# EAGLE schematic Tock (EAGLE 7.2.0)
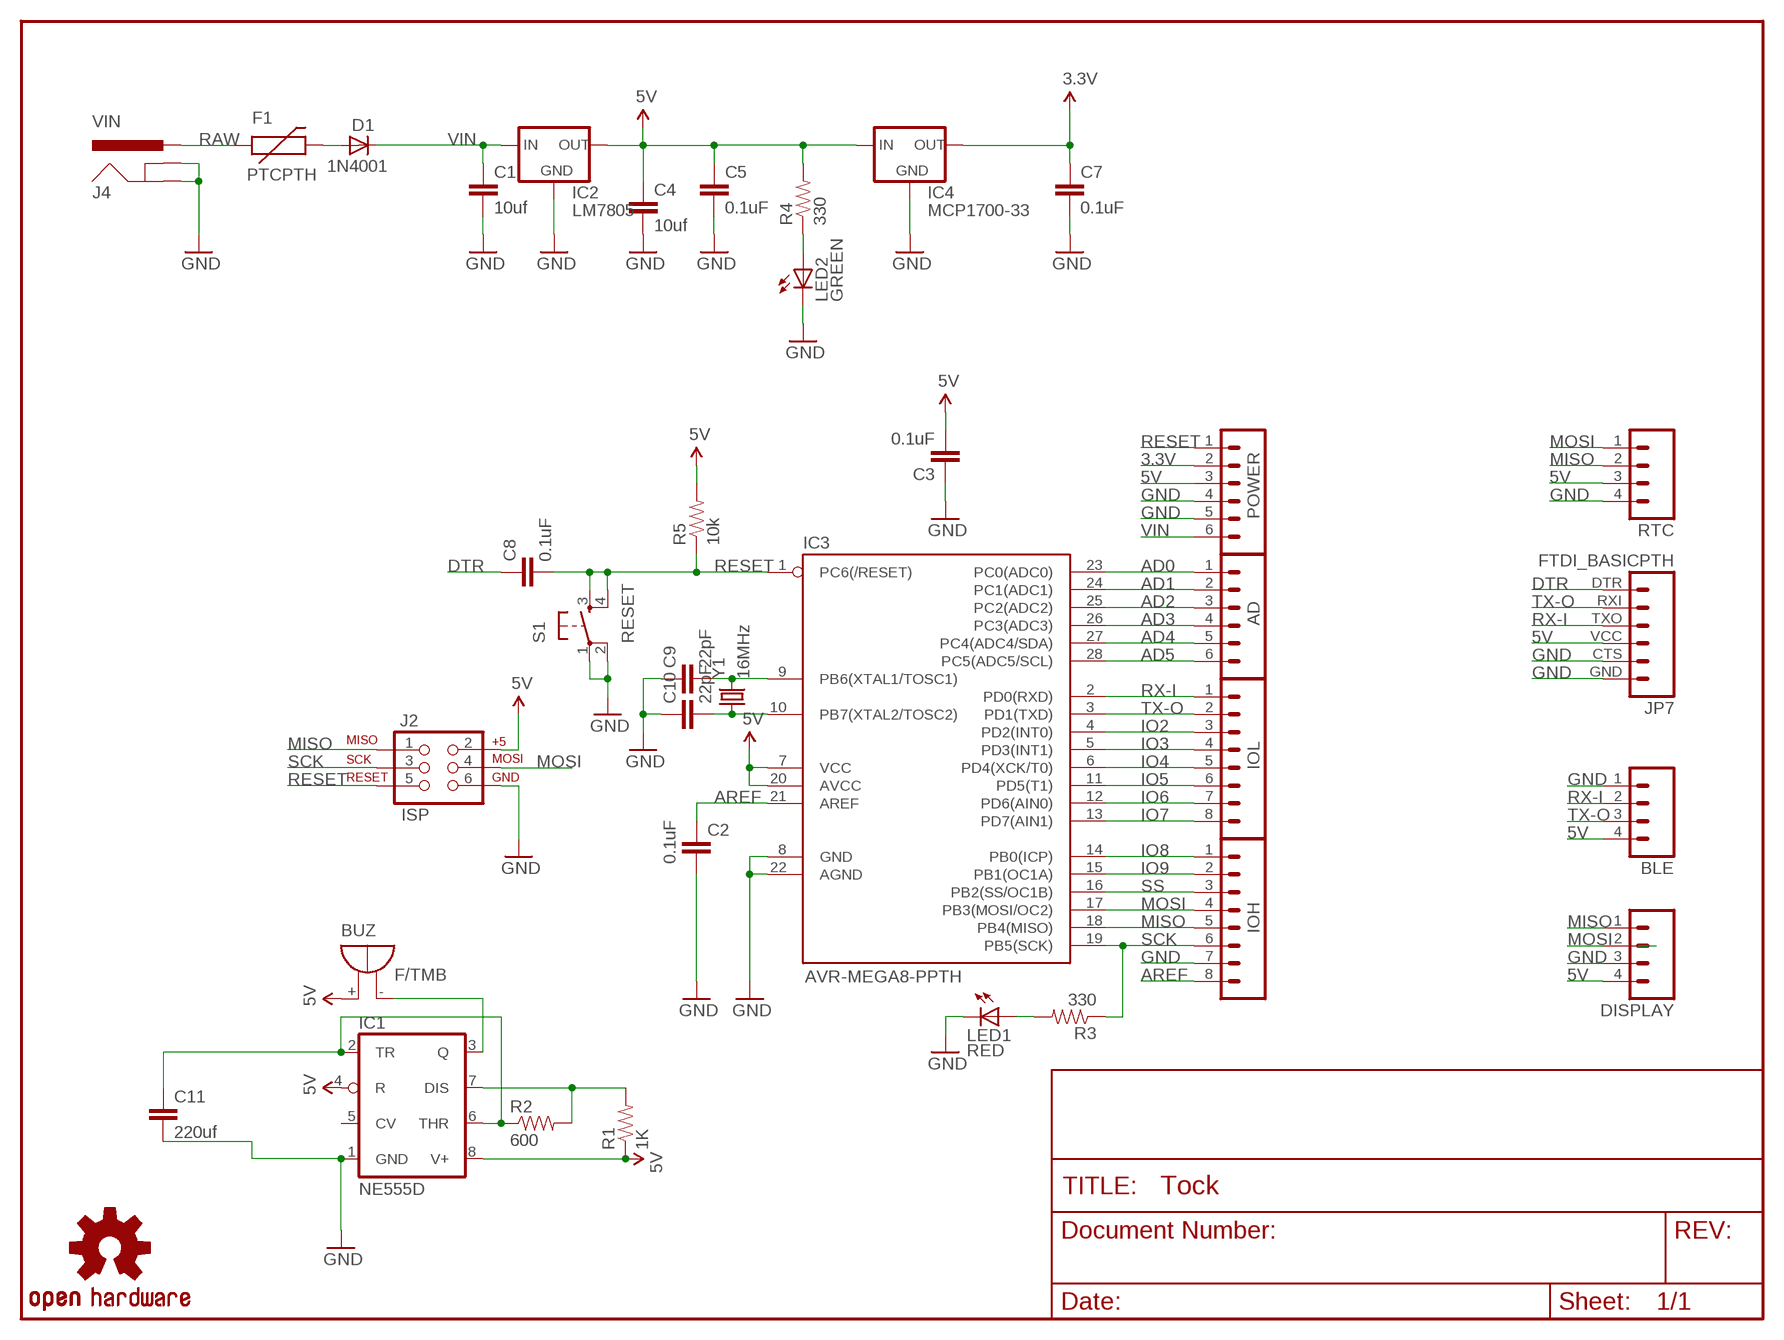
[diagram p0: schematic, sheet 1]

## Parts
AD  M06LOCK  [1X06_LOCK]
BLE  M04LOCK  [1X04_LOCK]
BUZ  F/TMB  [F/TMB]
C1  10uf  CAP0805  [0805]
C2  0.1uF  CAP0805  [0805]
C3  0.1uF  CAPPTH2  [CAP-PTH-SMALL2]
C4  10uf  CAP0805  [0805]
C5  0.1uF  CAP0805  [0805]
C7  0.1uF  CAP0805  [0805]
C8  0.1uF  CAP0805  [0805]
C9  22pF  CAP0805  [0805]
C10  22pF  CAP0805  [0805]
C11  220uf  CAP0805  [0805]
D1  1N4001  DIODEPTH  [DIODE-1N4001]
DISPLAY  M04LOCK  [1X04_LOCK]
F1  PTCPTH  [PTC]
IC1  NE555D  [SO08]
IC2  LM7805  V_REG_78XX-TO-220  [TO-220-ALT]
IC3  AVR-MEGA8-PPTH  [DIL28-3]
IC4  MCP1700-33  V_REG_78XXTO-92  [TO-92]
IOH  M08LOCK  [1X08_LOCK]
IOL  M08LOCK  [1X08_LOCK]
J2  ISP  AVR_SPI_PRG_6PTH  [2X3]
J4  VIN  POWER_JACKPTH_LOCK  [POWER_JACK_PTH_LOCK]
JP7  FTDI_BASICPTH  [FTDI_BASIC]
LED1  RED  LEDCHIP-LED0805  [CHIP-LED0805]
LED2  GREEN  LEDCHIP-LED0805  [CHIP-LED0805]
POWER  M06LOCK  [1X06_LOCK]
R1  1K  RESISTOR0805-RES  [0805]
R2  600  RESISTOR0805-RES  [0805]
R3  330  RESISTOR0805-RES  [0805]
R4  330  RESISTOR0805-RES  [0805]
R5  10k  RESISTOR0805-RES  [0805]
RTC  M04LOCK  [1X04_LOCK]
S1  RESET  TAC_SWITCHPTH  [TACTILE-PTH]
U$7  OSHW-LOGOM  [OSHW-LOGO-M]
Y1  16MHz  CRYSTALHC49US  [HC49US]

## Nets
3.3V: C7.1 IC4.3(OUT) POWER.2
5V [power]: BLE.4 BUZ.+ C3.2 C4.1 C5.1 DISPLAY.4 IC1.4(R) IC1.8(V+) IC2.OUT IC3.7(VCC) IC3.20(AVCC) IC4.2(IN) J2.2 JP7.VCC POWER.3 R1.1 R4.2 R5.2 RTC.3
AD0 [outpin]: AD.1 IC3.23(PC0(ADC0))
AD1 [outpin]: AD.2 IC3.24(PC1(ADC1))
AD2 [outpin]: AD.3 IC3.25(PC2(ADC2))
AD3 [outpin]: AD.4 IC3.26(PC3(ADC3))
AD4 [outpin]: AD.5 IC3.27(PC4(ADC4/SDA))
AD5 [outpin]: AD.6 IC3.28(PC5(ADC5/SCL))
AREF [outpin]: C2.1 IC3.21(AREF) IOH.8
DTR: C8.1 JP7.DTR
GND [power]: BLE.1 C1.2 C2.2 C3.1 C4.2 C5.2 C7.2 C9.1 C10.1 C11.2 DISPLAY.3 IC1.1(GND) IC2.GND IC3.8(GND) IC3.22(AGND) IC4.1(GND) IOH.7 J2.6 J4.GND J4.GNDBREAK JP7.CTS JP7.GND LED1.C LED2.C POWER.4 POWER.5 RTC.4 S1.1 S1.2
IO2 [outpin]: IC3.4(PD2(INT0)) IOL.3
IO3 [outpin]: IC3.5(PD3(INT1)) IOL.4
IO4 [outpin]: IC3.6(PD4(XCK/T0)) IOL.5
IO5 [outpin]: IC3.11(PD5(T1)) IOL.6
IO6 [outpin]: IC3.12(PD6(AIN0)) IOL.7
IO7 [outpin]: IC3.13(PD7(AIN1)) IOL.8
IO8 [outpin]: IC3.14(PB0(ICP)) IOH.1
IO9 [outpin]: IC3.15(PB1(OC1A)) IOH.2
MISO [outpin]: DISPLAY.1 IC3.18(PB4(MISO)) IOH.5 J2.1 RTC.2
MOSI: DISPLAY.2 IC3.17(PB3(MOSI/OC2)) IOH.4 J2.4 RTC.1
N$1: LED1.A R3.2
N$2: LED2.A R4.1
N$3: C9.2 IC3.9(PB6(XTAL1/TOSC1)) Y1.2
N$4: C10.2 IC3.10(PB7(XTAL2/TOSC2)) Y1.1
N$5: C11.1 IC1.2(TR) IC1.6(THR) R2.1
N$6: D1.A F1.P$2
N$7: BUZ.- IC1.3(Q)
N$9: IC1.7(DIS) R1.2 R2.2
RAW [power]: F1.P$1 J4.PWR
RESET: C8.2 IC3.1(PC6(/RESET)) J2.5 POWER.1 R5.1 S1.3 S1.4
RX-I [outpin]: BLE.2 IC3.2(PD0(RXD)) IOL.1 JP7.TXO
SCK [outpin]: IC3.19(PB5(SCK)) IOH.6 J2.3 R3.1
SS [outpin]: IC3.16(PB2(SS/OC1B)) IOH.3
TX-O [outpin]: BLE.3 IC3.3(PD1(TXD)) IOL.2 JP7.RXI
VIN [power]: C1.1 D1.C IC2.IN POWER.6
Unconnected: IC1.5(CV)

## Library data of the parts
AD POWER = SparkFun-Connectors:M06: Header 6 Standard 6-pin 0.1" header. Use with straight break away headers (SKU : PRT-00116), right angle break away headers (PRT-00553), swiss pins (PRT-00743), machine pins (PRT-00117), and female headers (PRT-00115). Molex polarized connector foot print use with SKU : PRT-08094 with associated crimp pins and housings. NOTES ON THE VARIANTS LOCK and LOCK_LONGPADS... This footprint was designed to help hold the alignment of a through-hole component (i.e. 6-pin header) while soldering it into place. You may notice that each hole has been shifted either up or down by 0.005 of an inch from it's more standard position (which is a perfectly straight line). This slight alteration caused the pins (the squares in the middle) to touch the edges of the holes. Because they are alternating, it causes a "brace" to hold the component in place. 0.005 has proven to be the perfect amount of "off-center" position when using our standard breakaway headers. Although looks a little odd when you look at the bare footprint, once you have a header in there, the alteration is very hard to notice. Also,if you push a header all the way into place, it is covered up entirely on the bottom side. This idea of altering the position of holes to aid alignment will be further integrated into the Sparkfun Library for other footprints. It can help hold any component with 3 or more connection pins.
BLE DISPLAY RTC = SparkFun-Connectors:M04: Header 4 Standard 4-pin 0.1" header. Use with straight break away headers (SKU : PRT-00116), right angle break away headers (PRT-00553), swiss pins (PRT-00743), machine pins (PRT-00117), and female headers (PRT-00115). Molex polarized connector foot print use with SKU : PRT-08231 with associated crimp pins and housings. 1MM SMD Version SKU: PRT-10208
BUZ = buzzer:F/TMB: BUZZER Source: Buerklin; OC_FARNELL: unknown; OC_NEWARK: unknown
C1 C2 C4 C5 C7-C11 = SparkFun-Passives:CAP: Capacitor Standard 0603 ceramic capacitor, and 0.1" leaded capacitor.
C3 = SparkFun:CAP: Capacitor Standard 0603 ceramic capacitor, and 0.1" leaded capacitor.
D1 = SparkFun:DIODE: Diode These are standard reverse protection diodes and small signal diodes. SMA package can handle up to about 1A. SOD-323 can handle about 200mA. What the SOD-323 package when ordering, there are some mfgs out there that are 5-pin packages.
F1 = SparkFun:PTC: Resettable Fuse PTC Resettable Fuse. Spark Fun Electronics SKU : COM-08357
IC1 = linear:*555: TIMER
IC2 IC4 = SparkFun:V_REG_78XX: Voltage Regulator Standard 7805 5V regulator. IGO (Input Ground Output). Spark Fun Electronics SKU : COM-00107
IC3 = SparkFun:AVR-MEGA8-P: MICROCONTROLLER 8 Kbytes FLASH 1 kbytes SRAM 512 bytes EEPROM USART 4-channel 10 bit ADC 2-channel 8 bit ADC
IOH IOL = SparkFun-Connectors:M08: Header 8 Standard 8-pin 0.1" header. Use with straight break away headers (SKU : PRT-00116), right angle break away headers (PRT-00553), swiss pins (PRT-00743), machine pins (PRT-00117), and female headers (PRT-00115).
J2 = SparkFun:AVR_SPI_PRG_6: AVR ISP 6 Pin This is the reduced ISP connector for AVR programming. Common on Arduino. This footprint will take up less PCB space and can be used with a 10-pin to 6-pin adapter such as SKU: BOB-08508
J4 = SparkFun:POWER_JACK: Power Jack This is the standard 5.5mm barrel jack for power. The PTH is the most common, proven, reliable, footprint. All others are experimental. The Slot footprint only works if the mill layer is transmitted to the PCB fab house so be warned. Spark Fun Electronics SKU : PRT-00119. Mating wall wart : TOL-00298 (and others)
JP7 = SparkFun:FTDI_BASIC: FTDI Basic: 3.3V and 5V
LED1 LED2 = led:LED: LED OSRAM: - CHIPLED LG R971, LG N971, LY N971, LG Q971, LY Q971, LO R971, LY R971 LH N974, LH R974 LS Q976, LO Q976, LY Q976 LO Q996 - Hyper CHIPLED LW Q18S LB Q993, LB Q99A, LB R99A - SideLED LS A670, LO A670, LY A670, LG A670, LP A670 LB A673, LV A673, LT A673, LW A673 LH A674 LY A675 LS A676, LA A676, LO A676, LY A676, LW A676 LS A679, LY A679, LG A679 - Hyper Micro SIDELED® LS Y876, LA Y876, LO Y876, LY Y876 LT Y87S - SmartLED LW L88C, LW L88S LB L89C, LB L89S, LG L890 LS L89K, LO L89K, LY L89K LS L896, LA L896, LO L896, LY L896 - TOPLED LS T670, LO T670, LY T670, LG T670, LP T670 LSG T670, LSP T670, LSY T670, LOP T670, LYG T670 LG T671, LOG T671, LSG T671 LB T673, LV T673, LT T673, LW T673 LH T674 LS T676, LA T676, LO T676, LY T676, LB T676, LH T676, LSB T676, LW T676 LB T67C, LV T67C, LT T67C, LS T67K, LO T67K, LY T67K, LW E67C LS E67B, LA E67B, LO E67B, LY E67B, LB E67C, LV E67C, LT E67C LW T67C LS T679, LY T679, LG T679 LS T770, LO T770, LY T770, LG T770, LP T770 LB T773, LV T773, LT T773, LW T773 LH T774 LS E675, LA E675, LY E675, LS T675 LS T776, LA T776, LO T776, LY T776, LB T776 LHGB T686 LT T68C, LB T68C - Hyper Mini TOPLED® LB M676 - Mini TOPLED Santana® LG M470 LS M47K, LO M47K, LY M47K Source: http://www.osram.convergy.de LUXEON: - LUMILED® LXK2-PW12-R00, LXK2-PW12-S00, LXK2-PW14-U00, LXK2-PW14-V00 LXK2-PM12-R00, LXK2-PM12-S00, LXK2-PM14-U00 LXK2-PE12-Q00, LXK2-PE12-R00, LXK2-PE12-S00, LXK2-PE14-T00, LXK2-PE14-U00 LXK2-PB12-K00, LXK2-PB12-L00, LXK2-PB12-M00, LXK2-PB14-N00, LXK2-PB14-P00, LXK2-PB14-Q00 LXK2-PR12-L00, LXK2-PR12-M00, LXK2-PR14-Q00, LXK2-PR14-R00 LXK2-PD12-Q00, LXK2-PD12-R00, LXK2-PD12-S00 LXK2-PH12-R00, LXK2-PH12-S00 LXK2-PL12-P00, LXK2-PL12-Q00, LXK2-PL12-R00 Source: www.luxeon.com KINGBRIGHT: KA-3528ASYC Source: www.kingbright.com
R1-R5 = SparkFun-Resistors:RESISTOR: Resistor Basic schematic elements and footprints for 0603, 1206, and PTH resistors.
S1 = SparkFun:TAC_SWITCH: Momentary Switch Button commonly used for reset or general input. Spark Fun Electronics SKU : COM-00097
U$7 = SparkFun:OSHW-LOGO: Open Source Hardware Logo This logo indicates the piece of hardware it is found on incorporates a OSHW license and/or adheres to the definition of open source hardware found here: http://freedomdefined.org/OSHW
Y1 = SparkFun:CRYSTAL: Crystals Various standard crystals. Proven footprints. Spark Fun Electronics SKU : COM-00534

## Net classes
0 default: width 0.203 mm, drill 0.305 mm, clearance 0.152 mm
1 power: width 1.016 mm, drill 0.305 mm, clearance 0.152 mm
2 outpin: width 0.203 mm, drill 0.305 mm, clearance 0.152 mm